# Altium schematic sheet connecter.SchDoc
size A3; PageSetup: Record=PageOptions|CenterHorizontal=True|CenterVertical=True|PrintScale=1.00|XCorrection=1.00|YCorrection=1.00|PrintKind=1|BorderSize=5000000|LeftOffset=0|BottomOffset=0|Orientation=2|PaperLength=1000|PaperWidth=1000|Scale=100|PaperSource=7|PrintQuality=-3|MediaType=1|DitherType=10|PrintScaleMode=1|PaperKind=A3|PaperIndex=8
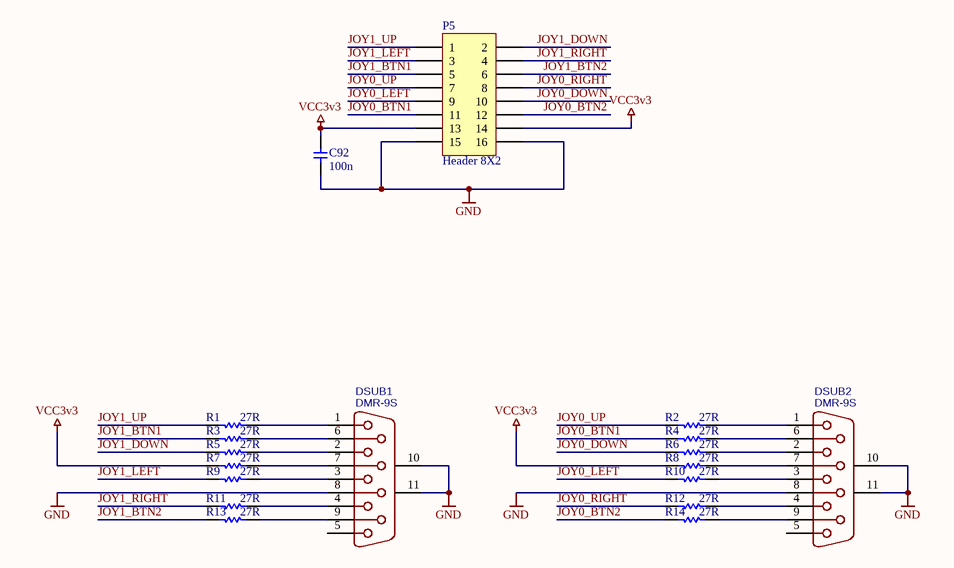
[diagram p0: connecter.SchDoc]

## Parts
C92  value 100n  [0603]  (hidden comment: 0603)
DSUB1  DMR-9S  [DSUB-TH_DMR-9S]
DSUB2  DMR-9S  [DSUB-TH_DMR-9S]
P5  Header 8X2  [HDR2X8]
R1  value 27R  [0603]  (hidden comment: 0603)
R2  value 27R  [0603]  (hidden comment: 0603)
R3  value 27R  [0603]  (hidden comment: 0603)
R4  value 27R  [0603]  (hidden comment: 0603)
R5  value 27R  [0603]  (hidden comment: 0603)
R6  value 27R  [0603]  (hidden comment: 0603)
R7  value 27R  [0603]  (hidden comment: 0603)
R8  value 27R  [0603]  (hidden comment: 0603)
R9  value 27R  [0603]  (hidden comment: 0603)
R10  value 27R  [0603]  (hidden comment: 0603)
R11  value 27R  [0603]  (hidden comment: 0603)
R12  value 27R  [0603]  (hidden comment: 0603)
R13  value 27R  [0603]  (hidden comment: 0603)
R14  value 27R  [0603]  (hidden comment: 0603)

## Nets
GND: C92.2 DSUB1.8 DSUB1.10(MH1) DSUB1.11(MH2) DSUB2.8 DSUB2.10(MH1) DSUB2.11(MH2) P5.15 P5.16
VCC3v3: C92.1 P5.13 P5.14 R7.2 R8.2
JOY0_BTN1: P5.11 R4.2
JOY0_BTN2: P5.12 R14.2
JOY0_DOWN: P5.10 R6.2
JOY0_LEFT: P5.9 R10.2
JOY0_RIGHT: P5.8 R12.2
JOY0_UP: P5.7 R2.2
JOY1_BTN1: P5.5 R3.2
JOY1_BTN2: P5.6 R13.2
JOY1_DOWN: P5.2 R5.2
JOY1_LEFT: P5.3 R9.2
JOY1_RIGHT: P5.4 R11.2
JOY1_UP: P5.1 R1.2
NetDSUB1_1: DSUB1.1 R1.1
NetDSUB1_2: DSUB1.2 R5.1
NetDSUB1_3: DSUB1.3 R9.1
NetDSUB1_4: DSUB1.4 R11.1
NetDSUB1_6: DSUB1.6 R3.1
NetDSUB1_7: DSUB1.7 R7.1
NetDSUB1_9: DSUB1.9 R13.1
NetDSUB2_1: DSUB2.1 R2.1
NetDSUB2_2: DSUB2.2 R6.1
NetDSUB2_3: DSUB2.3 R10.1
NetDSUB2_4: DSUB2.4 R12.1
NetDSUB2_6: DSUB2.6 R4.1
NetDSUB2_7: DSUB2.7 R8.1
NetDSUB2_9: DSUB2.9 R14.1

Not connected (* = marked no-connect by the designer): DSUB1 5; DSUB2 5

## Notes on the sheet
- Title
- Size:
- Date:
- A3
- Number:
- Time:
- Revision:
- Sheet
- of
- File:

## Library data of the parts
C92 = CAP_0603: 0603 footprint non-polorised capacitor
DSUB1 DSUB2 = DMR-9S: BOM_Manufacturer: Shenzhen Cankemeng; Contributor: LCSC; BOM_Supplier: LCSC; BOM_Supplier Part: C141882; BOM_Manufacturer Part: DMR-9S; BOM_JLCPCB Part Class: Extended Part; spicePre: D; spiceSymbolName: DMR-9S
P5 = Header 8X2: Header, 8-Pin, Dual row; LatestRevisionDate: 17-Jul-2002; LatestRevisionNote: Re-released for DXP Platform.; Publisher: Altium Limited
R1-R14 = RES_0603: 0603 footprint resistor